# EAGLE design fcf3 (EAGLE 9.5.2)
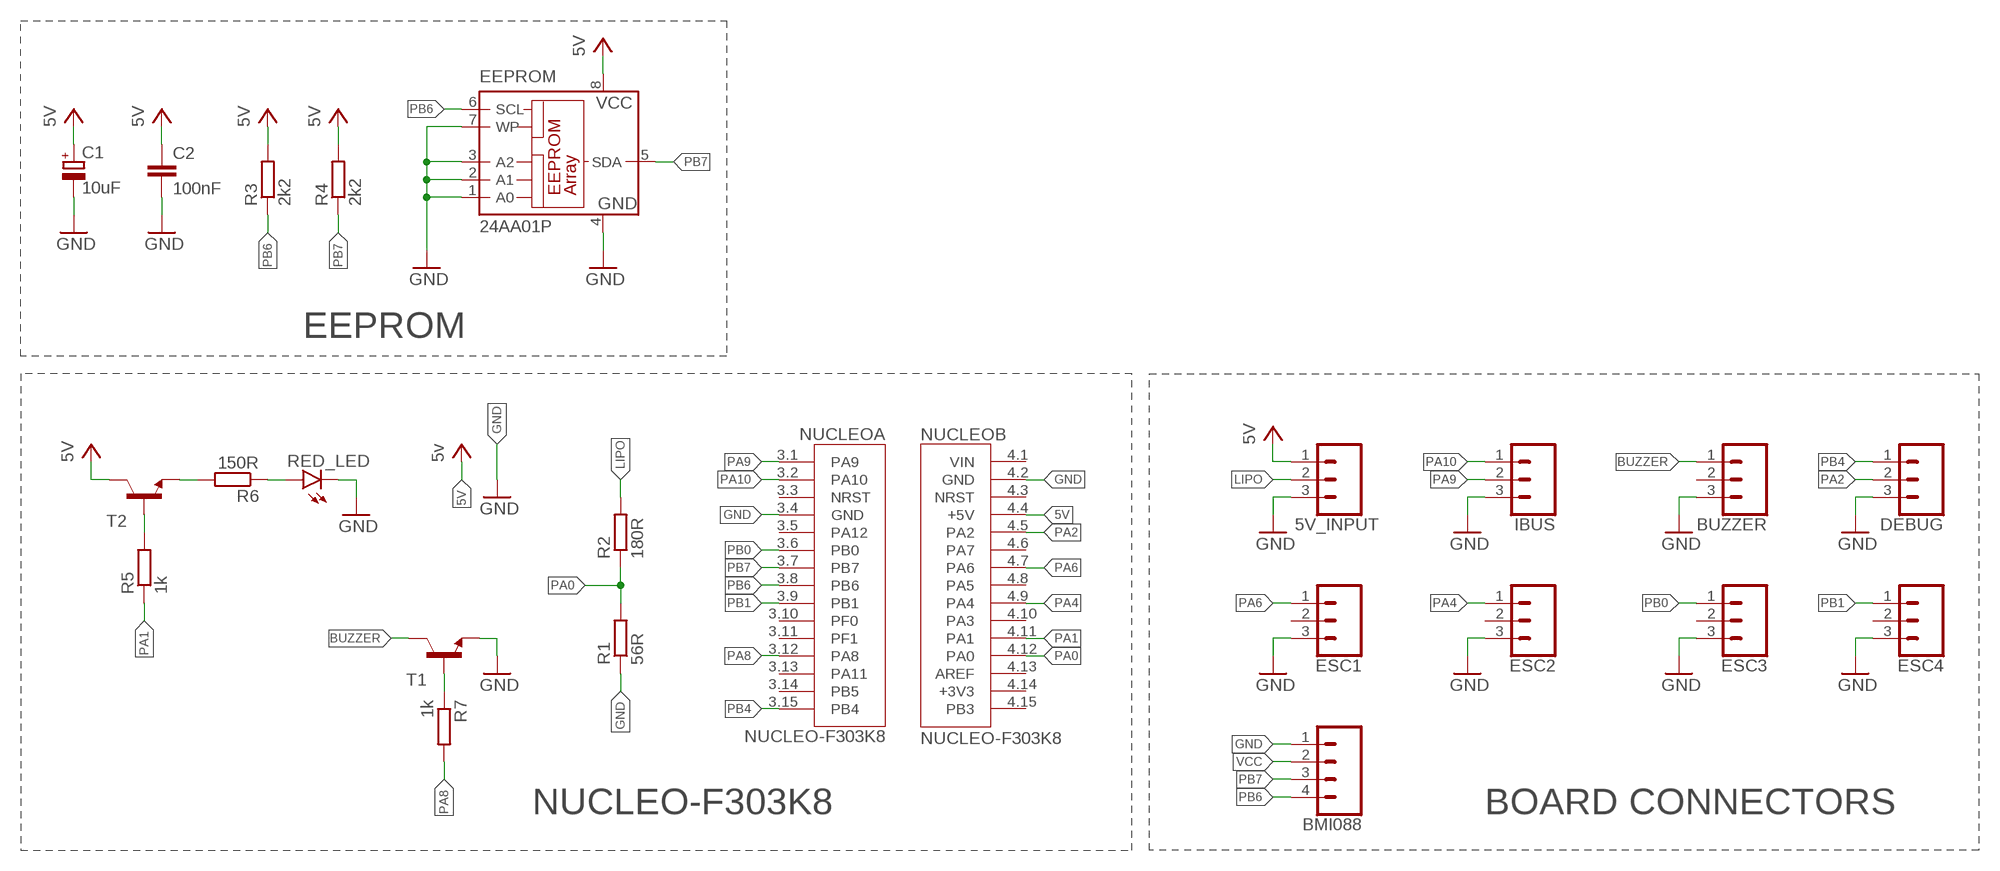
[diagram p0: schematic, sheet 1]

## Parts
5V_INPUT  CONN_03  [1X03]
BMI088  CONN_04  [1X04]
BUZZER  CONN_03  [1X03]
C1  10uF  CPOL-EUE2-5  [E2-5]
C2  100nF  C-EU025-024X044  [C025-024X044]
DEBUG  CONN_03  [1X03]
EEPROM  24AA01P  [DIL8]
ESC1  CONN_03  [1X03]
ESC2  CONN_03  [1X03]
ESC3  CONN_03  [1X03]
ESC4  CONN_03  [1X03]
IBUS  CONN_03  [1X03]
NUCLEO  NUCLEO-F303K8  [MODULE_NUCLEO-F303K8]
R1  56R  R-EU_0207/10  [0207/10]
R2  180R  R-EU_0207/10  [0207/10]
R3  2k2  R-EU_0207/10  [0207/10]
R4  2k2  R-EU_0207/10  [0207/10]
R5  1k  R-EU_0207/10  [0207/10]
R6  150R  R-EU_0207/10  [0207/10]
R7  1k  R-EU_0207/10  [0207/10]
RED_LED  LED3MM  [LED3MM]
T1  -NPN-TO92  [TO92]
T2  -NPN-TO92  [TO92]

## Nets
5V: NUCLEO.4.4(B:+5V) ; supply symbol labelled 5v
BUZZER: BUZZER.1 T1.3(C)
GND: 5V_INPUT.3 BMI088.1 BUZZER.3 C1.- C2.2 DEBUG.3 EEPROM.1(A0) EEPROM.2(A1) EEPROM.3(A2) EEPROM.4(GND) EEPROM.7(WP) ESC1.3 ESC2.3 ESC3.3 ESC4.3 IBUS.3 NUCLEO.3.4(A:GND) NUCLEO.4.2(B:GND) R1.1 RED_LED.K(C) T1.1(E)
LIPO: 5V_INPUT.2 R2.2
N$1: R5.2 T2.2(B)
N$2: R6.2 T2.1(E)
N$3: R6.1 RED_LED.A
N$4: R7.1 T1.2(B)
PA0: NUCLEO.4.12(B:PA0) R1.2 R2.1
PA1: NUCLEO.4.11(B:PA1) R5.1
PA2: DEBUG.2 NUCLEO.4.5(B:PA2)
PA4: ESC2.1 NUCLEO.4.9(B:PA4)
PA6: ESC1.1 NUCLEO.4.7(B:PA6)
PA8: NUCLEO.3.12(A:PA8) R7.2
PA9: IBUS.2 NUCLEO.3.1(A:PA9)
PA10: IBUS.1 NUCLEO.3.2(A:PA10)
PB0: ESC3.1 NUCLEO.3.6(A:PB0)
PB1: ESC4.1 NUCLEO.3.9(A:PB1)
PB4: DEBUG.1 NUCLEO.3.15(A:PB4)
PB6: BMI088.4 EEPROM.6(SCL) NUCLEO.3.8(A:PB6) R3.1
PB7: BMI088.3 EEPROM.5(SDA) NUCLEO.3.7(A:PB7) R4.1
VCC: 5V_INPUT.1 BMI088.2 C1.+ C2.1 EEPROM.8(VCC) R3.2 R4.2 T2.3(C) ; supply symbol labelled 5V
Unconnected: BUZZER.2 ESC1.2 ESC2.2 ESC3.2 ESC4.2 NUCLEO.3.3(A:NRST) NUCLEO.3.5(A:PA12) NUCLEO.3.10(A:PF0) NUCLEO.3.11(A:PF1) NUCLEO.3.13(A:PA11) NUCLEO.3.14(A:PB5) NUCLEO.4.1(B:VIN) NUCLEO.4.3(B:NRST) NUCLEO.4.6(B:PA7) NUCLEO.4.8(B:PA5) NUCLEO.4.10(B:PA3) NUCLEO.4.13(B:AREF) NUCLEO.4.14(B:+3V3) NUCLEO.4.15(B:PB3)

## Notes on the sheet
- EEPROM
- NUCLEO-F303K8 | BOARD CONNECTORS

## Library data of the parts
5V_INPUT BUZZER DEBUG ESC1-ESC4 IBUS = SparkFun-Connectors:CONN_03: Multi connection point. Often used as Generic Header-pin footprint for 0.1 inch spaced/style header connections On any of the 0.1 inch spaced packages, you can populate with these: Break Away Headers - Straight <https://www.sparkfun.com/products/116> (PRT-00116) Break Away Male Headers - Right Angle <https://www.sparkfun.com/products/553> (PRT-00553) Female Headers <https://www.sparkfun.com/products/115> (PRT-00115) Break Away Headers - Machine Pin <https://www.sparkfun.com/products/117> (PRT-00117) Break Away Female Headers - Swiss Machine Pin <https://www.sparkfun.com/products/743> (PRT-00743) Stackable Header - 3 Pin (Female, 0.1") <https://www.sparkfun.com/products/13875> (PRT-13875) For SCREWTERMINALS and SPRING TERMINALS visit here: Screw Terimnals on SparkFun.com <https://www.sparkfun.com/search/results?term=Screw+Terminals> (5mm/3.5mm/2.54mm spacing) This device is also useful as a general connection point to wire up your design to another part of your project. Our various solder wires solder well into these plated through hole pads. Hook-Up Wire - Assortment (Stranded, 22 AWG) <https://www.sparkfun.com/products/11375> (PRT-11375) Hook-Up Wire - Assortment (Solid Core, 22 AWG) <https://www.sparkfun.com/products/11367> (PRT-11367) View the entire wire category on our website here <https://www.sparkfun.com/categories/141> Special notes: Molex polarized connector foot print use with SKU : PRT-08232 with associated crimp pins and housings.
BMI088 = SparkFun-Connectors:CONN_04: Multi connection point. Often used as Generic Header-pin footprint for 0.1 inch spaced/style header connections On any of the 0.1 inch spaced packages, you can populate with these: Break Away Headers - Straight <https://www.sparkfun.com/products/116> (PRT-00116) Break Away Male Headers - Right Angle <https://www.sparkfun.com/products/553> (PRT-00553) Female Headers <https://www.sparkfun.com/products/115> (PRT-00115) Break Away Headers - Machine Pin <https://www.sparkfun.com/products/117> (PRT-00117) Break Away Female Headers - Swiss Machine Pin <https://www.sparkfun.com/products/743> (PRT-00743) For SCREWTERMINALS and SPRING TERMINALS visit here: Screw Terimnals on SparkFun.com <https://www.sparkfun.com/search/results?term=Screw+Terminals> (5mm/3.5mm/2.54mm spacing) This device is also useful as a general connection point to wire up your design to another part of your project. Our various solder wires solder well into these plated through hole pads. Hook-Up Wire - Assortment (Stranded, 22 AWG) <https://www.sparkfun.com/products/11375> (PRT-11375) Hook-Up Wire - Assortment (Solid Core, 22 AWG) <https://www.sparkfun.com/products/11367> (PRT-11367) View the entire wire category on our website here <https://www.sparkfun.com/categories/141> Special notes: Molex polarized connector foot print use with SKU : PRT-08231 with associated crimp pins and housings. 1MM SMD Version SKU: PRT-10208; PROD_ID: CONN-09696
C1 = rcl:CPOL-EU: POLARIZED CAPACITOR, European symbol; SPICEPREFIX: C
C2 = rcl:C-EU: CAPACITOR, European symbol; SPICEPREFIX: C
EEPROM = microchip:24*: Serial EEPROM I2C; MPN: 24AA01-I/P; OC_FARNELL: 1331266; OC_NEWARK: 35M0692
NUCLEO = NUCLEO-F303K8:NUCLEO-F303K8: STM32 Nucleo-32 development board with STM32F303K8T6 MCU, supports Arduino connectivity; AVAILABILITY: Unavailable; DESCRIPTION: STM32F303K8, mbed-Enabled Development Nucleo-32 STM32F3 ARM® Cortex®-M4 MCU 32-Bit Embedded Evaluation Board; MF: STMicroelectronics; MP: NUCLEO-F303K8; PACKAGE: None; PRICE: None
R1-R7 = rcl:R-EU_: RESISTOR, European symbol; SPICEPREFIX: R
RED_LED = led:LED: LED OSRAM: - CHIPLED LG R971, LG N971, LY N971, LG Q971, LY Q971, LO R971, LY R971 LH N974, LH R974 LS Q976, LO Q976, LY Q976 LO Q996 - Hyper CHIPLED LW Q18S LB Q993, LB Q99A, LB R99A - SideLED LS A670, LO A670, LY A670, LG A670, LP A670 LB A673, LV A673, LT A673, LW A673 LH A674 LY A675 LS A676, LA A676, LO A676, LY A676, LW A676 LS A679, LY A679, LG A679 - Hyper Micro SIDELED® LS Y876, LA Y876, LO Y876, LY Y876 LT Y87S - SmartLED LW L88C, LW L88S LB L89C, LB L89S, LG L890 LS L89K, LO L89K, LY L89K LS L896, LA L896, LO L896, LY L896 - TOPLED LS T670, LO T670, LY T670, LG T670, LP T670 LSG T670, LSP T670, LSY T670, LOP T670, LYG T670 LG T671, LOG T671, LSG T671 LB T673, LV T673, LT T673, LW T673 LH T674 LS T676, LA T676, LO T676, LY T676, LB T676, LH T676, LSB T676, LW T676 LB T67C, LV T67C, LT T67C, LS T67K, LO T67K, LY T67K, LW E67C LS E67B, LA E67B, LO E67B, LY E67B, LB E67C, LV E67C, LT E67C LW T67C LS T679, LY T679, LG T679 LS T770, LO T770, LY T770, LG T770, LP T770 LB T773, LV T773, LT T773, LW T773 LH T774 LS E675, LA E675, LY E675, LS T675 LS T776, LA T776, LO T776, LY T776, LB T776 LHGB T686 LT T68C, LB T68C - Hyper Mini TOPLED® LB M676 - Mini TOPLED Santana® LG M470 LS M47K, LO M47K, LY M47K Source: http://www.osram.convergy.de LUXEON: - LUMILED® LXK2-PW12-R00, LXK2-PW12-S00, LXK2-PW14-U00, LXK2-PW14-V00 LXK2-PM12-R00, LXK2-PM12-S00, LXK2-PM14-U00 LXK2-PE12-Q00, LXK2-PE12-R00, LXK2-PE12-S00, LXK2-PE14-T00, LXK2-PE14-U00 LXK2-PB12-K00, LXK2-PB12-L00, LXK2-PB12-M00, LXK2-PB14-N00, LXK2-PB14-P00, LXK2-PB14-Q00 LXK2-PR12-L00, LXK2-PR12-M00, LXK2-PR14-Q00, LXK2-PR14-R00 LXK2-PD12-Q00, LXK2-PD12-R00, LXK2-PD12-S00 LXK2-PH12-R00, LXK2-PH12-S00 LXK2-PL12-P00, LXK2-PL12-Q00, LXK2-PL12-R00 Source: www.luxeon.com KINGBRIGHT: KA-3528ASYC Source: www.kingbright.com
T1 T2 = transistor:*-NPN-: NPN Transistror BF959 corrected 2008.03.06

## Board
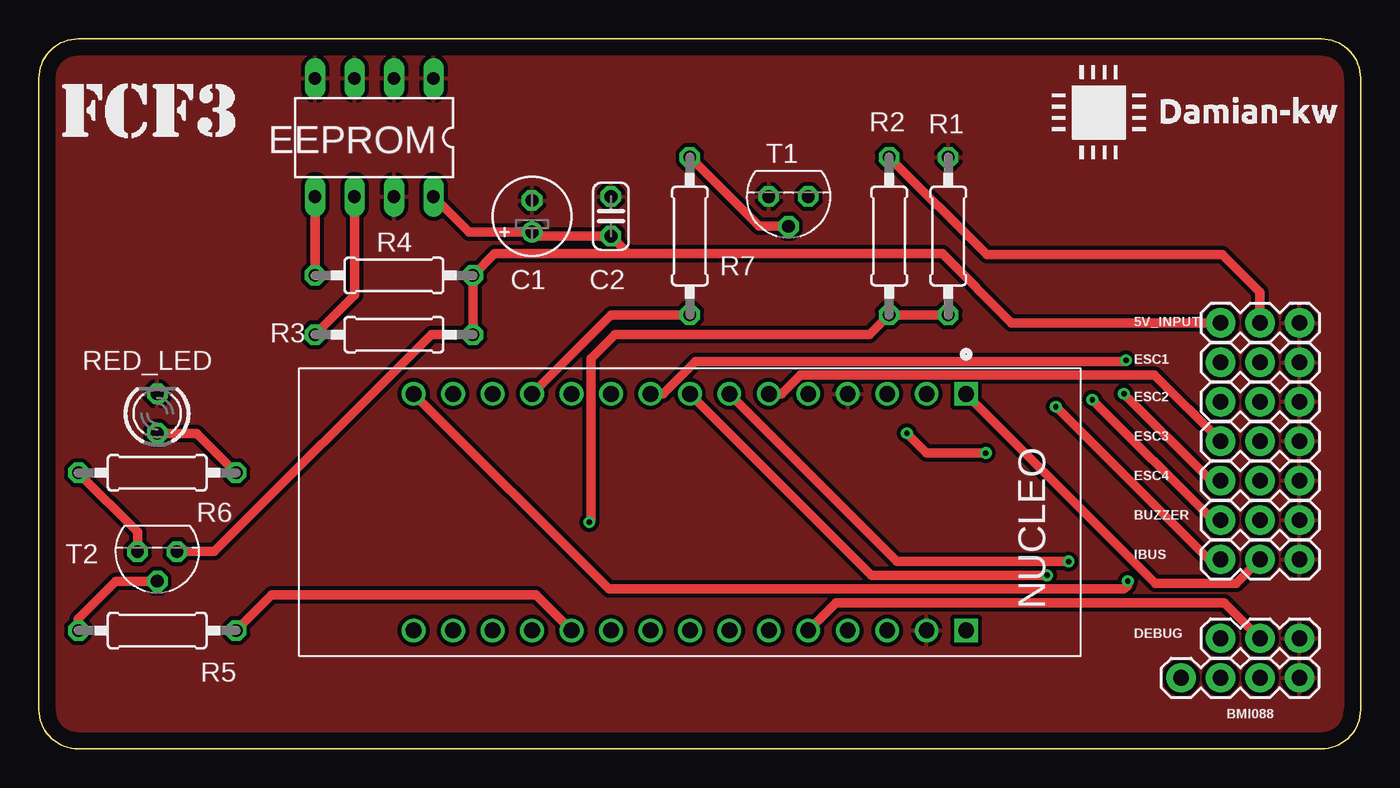
[diagram p1: board, top side]
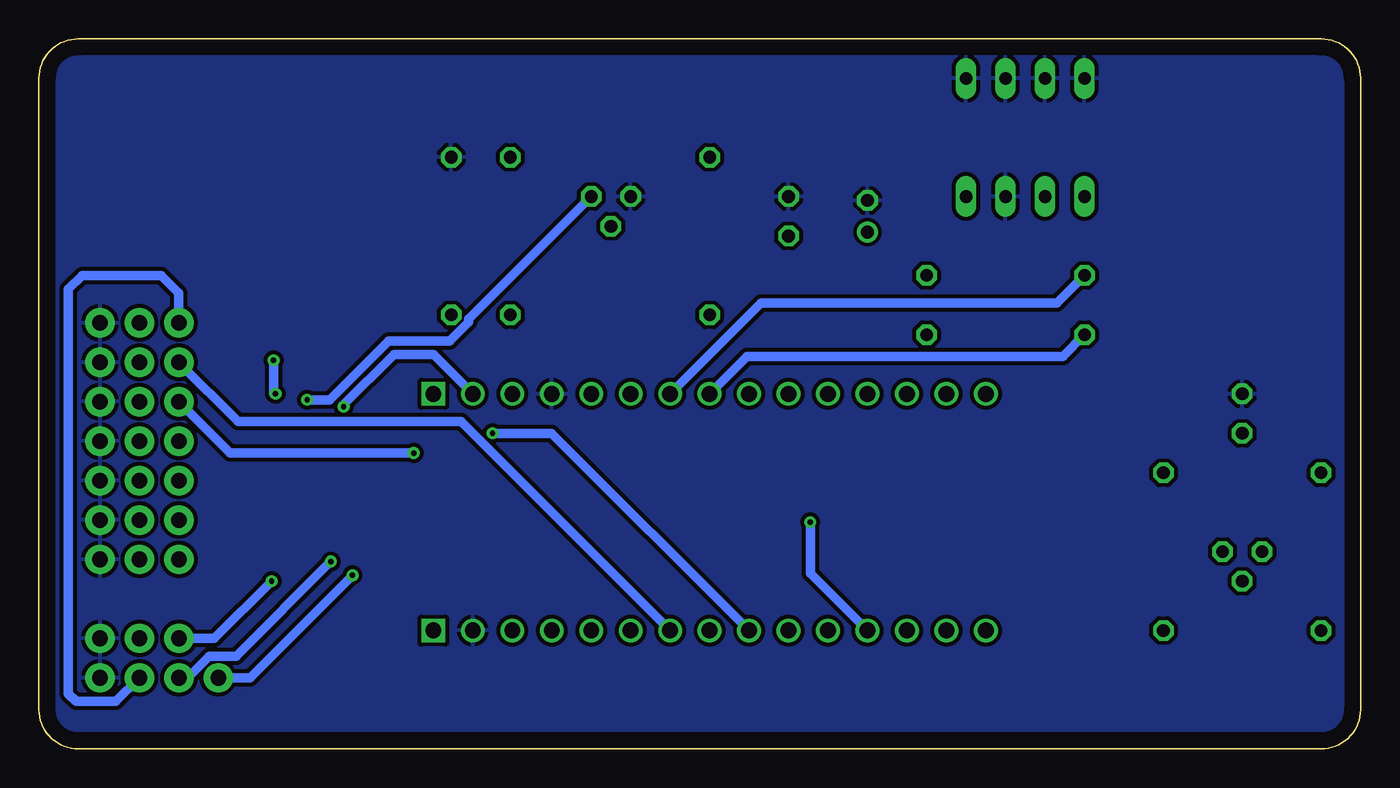
[diagram p2: board, bottom side, seen from below]

Size 85.09 x 45.72 mm. Coordinates in mm from the lower left corner, seen from the top.
Outline: 0,43.18 arc-90 2.54,45.72 82.55,45.72 arc-90 85.09,43.18 85.09,2.54 arc-90 82.55,0 2.54,0 arc-90 0,2.54 0,43.18
Copper layers (1*16): Top 0.035mm / dielectric 1.5mm / Bottom 0.035mm
Design rules "default *": minimum track width 24mil, minimum drill 0.35mm, track to track 10mil, track to pad 6mil, pad to pad 6mil, via to via 6mil, smd to smd 6mil, copper to edge 40mil, drill to drill 6mil, minimum pad ring 10mil, minimum via ring 8mil, stop-mask expansion 4mil, vias tented up to drill 15mil, thermal gap 10mil

### Footprints (pad centres in the part's own frame; a part is rotated, then mirrored left to right if it is on the bottom)
1X03 = drill 1.016 pad 1.88: 1 0,0; 2 2.54,0; 3 5.08,0
1X04 = drill 1.016 pad 1.88: 1 0,0; 2 2.54,0; 3 5.08,0; 4 7.62,0
E2-5 = drill 0.813 pad 1.27: + -1.016,0 | drill 0.813 pad 1.27 octagon: - 1.016,0
C025-024X044 = drill 0.813 octagon: 1 -1.27,0; 2 1.27,0
DIL8 = drill 0.813 long: 1 -3.81,-3.81; 2 -1.27,-3.81; 3 1.27,-3.81; 4 3.81,-3.81; 5 3.81,3.81; 6 1.27,3.81; 7 -1.27,3.81; 8 -3.81,3.81
MODULE_NUCLEO-F303K8 = drill 1.02 square: 3.1 -7.62,17.78; 4.1 7.62,17.78 | drill 1.02: 3.2 -7.62,15.24; 3.3 -7.62,12.7; 3.4 -7.62,10.16; 3.5 -7.62,7.62; 3.6 -7.62,5.08; 3.7 -7.62,2.54; 3.8 -7.62,0; 3.9 -7.62,-2.54; 3.10 -7.62,-5.08; 3.11 -7.62,-7.62; 3.12 -7.62,-10.16; 3.13 -7.62,-12.7; 3.14 -7.62,-15.24; 3.15 -7.62,-17.78; 4.2 7.62,15.24; 4.3 7.62,12.7; 4.4 7.62,10.16; 4.5 7.62,7.62; 4.6 7.62,5.08; 4.7 7.62,2.54; 4.8 7.62,0; 4.9 7.62,-2.54; 4.10 7.62,-5.08; 4.11 7.62,-7.62; 4.12 7.62,-10.16; 4.13 7.62,-12.7; 4.14 7.62,-15.24; 4.15 7.62,-17.78
0207/10 = drill 0.813 octagon: 1 -5.08,0; 2 5.08,0
LED3MM = drill 0.813 octagon: A -1.27,0; K 1.27,0
TO92 = drill 0.813 octagon: 1 1.27,0; 2 0,1.905; 3 -1.27,0

### Placement (x,y rotation side)
5V_INPUT  76.07,27.43 0 top
BMI088  81.15,4.57 180 top
BUZZER  76.07,14.73 0 top
C1  31.75,34.29 90 top
C2  36.83,34.29 90 top
DEBUG  76.07,7.11 0 top
EEPROM  21.59,39.37 180 top
ESC1  76.07,24.89 0 top
ESC2  76.07,22.35 0 top
ESC3  76.07,19.81 0 top
ESC4  76.07,17.27 0 top
IBUS  76.07,12.19 0 top
NUCLEO  41.91,15.24 270 top
R1  58.55,33.02 270 top
R2  54.74,33.02 90 top
R3  22.86,26.67 0 top
R4  22.86,30.48 0 top
R5  7.62,7.62 180 top
R6  7.62,17.78 180 top
R7  41.91,33.02 270 top
RED_LED  7.62,21.59 90 top
T1  48.26,35.56 180 top
T2  7.62,12.7 180 top

### Tracks (layer width: path | path; a pad name or v marks a point on that pad's centre or on a via)
BUZZER  (via drill 0.35)
  Top 0.61: v67.82,22.48 75.56,14.73 BUZZER.1
  Bottom 0.61: T1.3 57.43,27.66 57.43,27.48 58.64,26.26 62.59,26.26 66.37,22.48 v67.82,22.48
GND
  pour Top (isolate 0.254): 0,43.18 arc-90 2.54,45.72 54.61,45.72 81.28,45.72 82.55,45.72 arc-90 85.09,43.18 85.09,2.54 arc-90 82.55,0 48.26,0 3.81,0 2.54,0 arc-90 0,2.54 0,22.86
  pour Bottom (isolate 0.254): 0,26.67 0,43.18 arc-90 2.54,45.72 58.42,45.72 82.55,45.72 arc-90 85.09,43.18 85.09,3.81 85.09,2.54 arc-90 82.55,0 29.21,0 5.08,0 2.54,0 arc-90 0,2.54
LIPO
  Top 0.61: R2.2 61.02,31.81 76.2,31.81 78.61,29.4 5V_INPUT.2
N$1
  Top 0.61: T2.2 4.95,10.79 2.54,8.38 R5.2
N$2
  Top 0.61: R6.2 6.35,13.97 T2.1
N$3
  Top 0.61: RED_LED.A 10.16,20.32 R6.1
N$4
  Top 0.61: R7.1 46.35,33.66 T1.2
PA0  (via drill 0.35)
  Top 0.61: R1.2 R2.1 53.47,26.67 37.08,26.67 35.56,25.15 35.56,14.73 v35.43,14.61
  Bottom 0.61: v35.43,14.61 35.43,11.3 NUCLEO.4.12
PA1
  Top 0.61: NUCLEO.4.11 32,9.91 14.99,9.91 R5.1
PA2
  Top 0.61: NUCLEO.4.5 51.31,9.4 76.33,9.4 DEBUG.2
PA4  (via drill 0.35)
  Top 0.61: v60.96,19.05 57.15,19.05 v55.88,20.32
  Bottom 0.61: NUCLEO.4.9 52.07,20.32 v55.88,20.32 | v60.96,19.05 72.77,19.05 ESC2.1
PA6
  Bottom 0.61: ESC1.1 72.26,21.08 57.91,21.08 NUCLEO.4.7
PA8
  Top 0.61: NUCLEO.3.12 36.83,27.94 R7.2
PA9
  Top 0.61: IBUS.2 77.09,10.67 71.88,10.67 NUCLEO.3.1
PA10  (via drill 0.35)
  Top 0.61: v65.47,22.04 75.31,12.19 IBUS.1
  Bottom 0.61: NUCLEO.3.2 59.69,25.4 62.23,25.4 65.53,22.1 v65.47,22.04
PB0
  Top 0.61: NUCLEO.3.6 47.8,22.86 49.02,24.08 71.8,24.08 ESC3.1
PB1  (via drill 0.35)
  Top 0.61: NUCLEO.3.9 40.18,22.86 42.27,24.95 69.98,24.95 v69.98,25.02 | ESC4.1 75.44,17.27 v69.85,22.86
  Bottom 0.61: v69.98,25.02 69.98,22.86 v69.85,22.86
PB4  (via drill 0.35)
  Top 0.61: NUCLEO.3.15 36.7,10.29 69.85,10.29 70.1,10.54 v70.1,10.79
  Bottom 0.61: v70.1,10.79 73.79,7.11 DEBUG.1
PB6  (via drill 0.35)
  Top 0.61: EEPROM.6 20.32,29.21 R3.1 | NUCLEO.3.8 53.59,11.18 v64.9,11.18
  Bottom 0.61: R3.1 19.18,25.27 39.5,25.27 NUCLEO.3.8 | v64.9,11.18 71.5,4.57 BMI088.4
PB7  (via drill 0.35)
  Top 0.61: EEPROM.5 R4.1 | NUCLEO.3.7 55.24,12.06 v66.29,12.06
  Bottom 0.61: R4.1 19.56,28.7 38.61,28.7 NUCLEO.3.7 | v66.29,12.06 72.39,5.97 74.11,5.97 75.51,4.57 BMI088.3
VCC
  Top 0.61: 5V_INPUT.1 62.61,27.43 58.17,31.88 37.97,31.88 | 37.97,31.88 C2.1 32,33.02 C1.+ 27.69,33.27 EEPROM.8 | 37.97,31.88 29.34,31.88 R4.2 R3.2 25.27,26.67 11.3,12.7 T2.3
  Bottom 0.61: BMI088.2 80.14,3.05 82.68,3.05 83.19,3.56 83.19,29.59 82.3,30.48 77.22,30.48 76.07,29.34 5V_INPUT.1